# Altium project nixie display ark.PrjPCB
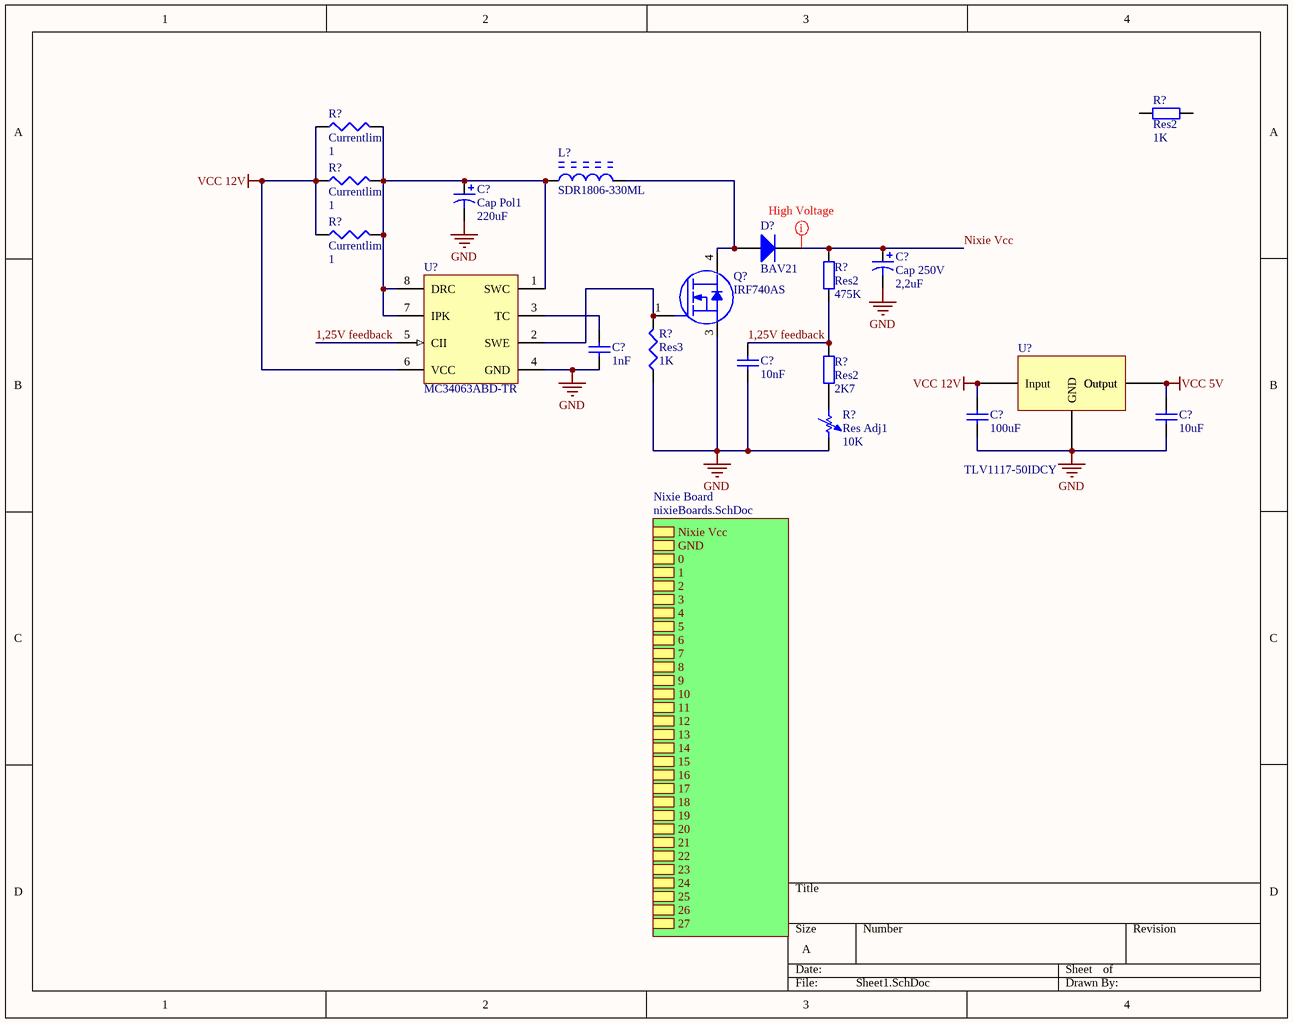
[diagram p0: Sheet1.SchDoc]
2 sheets, 31 parts. Net scope: hierarchical (ports join the sheet entries above them; power ports are global).
Sheets:
  Sheet1.SchDoc
    Nixie Board = nixieBoards.SchDoc

## Sheet Sheet1.SchDoc
size A

### Parts
(Parts that share a designator on the sheet are numbered #1, #2 ... from top to bottom, then left to right.)
C?#1  Cap Pol1  value 220uF  [RB7.6-15]
C?#2  Cap 250V  value 2,2uF  [RB7.6-15]
C?#3  1nF  [CAPC0805(2012)145_M]
C?#4  10nF  [CAPC0805(2012)145_M]
C?#5  100uF  [CAPC0805(2012)145_M]
C?#6  10uF  [CAPC0805(2012)145_M]
D?  BAV21  [DO-41]
L?  SDR1806-330ML  [BOUR-SDR1806_V]
Q?  IRF740AS  [TO-263AB]
R?#1  Res2  value 1K  [AXIAL-0.4]
R?#2  Currentlim  value 1  [J1-0603]
R?#3  Currentlim  value 1  [J1-0603]
R?#4  Currentlim  value 1  [J1-0603]
R?#5  Res2  value 475K  [AXIAL-0.4]
R?#6  Res3  value 1K  [J1-0603]
R?#7  Res2  value 2K7  [AXIAL-0.4]
R?#8  Res Adj1  value 10K  [AXIAL-0.7]
U?#1  MC34063ABD-TR  [SO8_N]
U?#2  TLV1117-50IDCY  [SOT-223-2]

### Sub-sheets
Nixie Board = nixieBoards.SchDoc: Nixie Vcc, GND, 0, 1, 2, 3, 4, 5, 6, 7, 8, 9, 10, 11, 12, 13, 14, 15, 16, 17, 18, 19, 20, 21, 22, 23, 24, 25, 26, 27

### Nets
GND: C?#1.2 C?#2.2 C?#3.1 C?#4.1 C?#5.1 C?#6.1 Q?.3(Drain) R?#6.1 R?#8.2 U?#1.4(GND) U?#2.1(GND)
VCC 5V: C?#6.2 U?#2.2(Output) U?#2.4(Output)
VCC 12V: C?#5.2 R?#2.1 R?#3.1 R?#4.1 U?#1.6(VCC) U?#2.3(Input)
1,25V feedback: C?#4.2 R?#5.1 R?#7.2 U?#1.5(CII)
Nixie Vcc: C?#2.1 D?.2(K) R?#5.2
NetC?#1_1: C?#1.1 L?.1 R?#2.2 R?#3.2 R?#4.2 U?#1.1(SWC) U?#1.7(IPK) U?#1.8(DRC)
NetC?#3_2: C?#3.2 U?#1.3(TC)
NetD?_1: D?.1(A) L?.2 Q?.4(Source)
NetQ?_1: Q?.1(Gate) R?#6.2 U?#1.2(SWE)
NetR?#7_1: R?#7.1 R?#8.1

Not connected (* = marked no-connect by the designer): R?#1 1 2

### Layout directives
mark named High Voltage: Nixie Vcc

### Library data of the parts
C?#1 C?#2 = Cap Pol1: Polarized Capacitor (Radial); Published: 8-Jun-2000; LatestRevisionDate: 17-Jul-2002; LatestRevisionNote: Re-released for DXP Platform.; PackageReference: RB7.6-15; Publisher: Altium Limited; PackageDescription: Polarized Capacitor (Radial); 2 Leads
C?#3 C?#4 = CMP-1036-03245-1: CAP 2.2nF 16V ±10% 0805 (2012 Metric) Thickness 1.45mm SMD; Case-EIA: 0805; Tolerance: Â±10%; Case-Metric: 2012; Rated Voltage: 16 V; Technology: SMT; Value: 2.2nF; Max Thickness: 1.45 mm
C?#5 C?#6 = CMP-1036-03245-1: Rated Voltage: 16 V; Case-EIA: 0805; Tolerance: Â±10%; Case-Metric: 2012; Technology: SMT; Max Thickness: 1.45 mm
  C?#5: Value: 100uF
  C?#6: Value: 10uF
D? = Diode 1N4006: Published: 8-Jun-2000; LatestRevisionDate: 17-Jul-2002; LatestRevisionNote: Re-released for DXP Platform.; DatasheetVersion: 1998; PackageVersion: Aug-1999; PackageReference: DO-41; Publisher: Altium Limited; PackageDescription: Diode, Axial; Body 5.2 x 2.7 mm (LxDia. max), Lead Dia. 0.86 mm (max); Code_JEDEC: DO-204-AL; ComponentLink1Description: Manufacturer Link; ComponentLink1URL: http://www.fairchildsemi.com/; ComponentLink2Description: Datasheet; ComponentLink2URL: http://www.fairchildsemi.com/ds/1N%2F1N4001.pdf
L? = CMP-2000-07043-1: Power Inductor, 33 uH, +/- 20%, -40 to 125 degC, 2-Pin SMD, RoHS, Tape and Reel; Manufacturer: Bourns; Minimum Quality Factor: 24@2.52MHz; Product Height: 6.9mm; Core Material: Ferrite; Maximum DC Current: 3A; Maximum DC Resistance: 68mOhm; Product Depth: 14.3mm; Inductance: 33uH; Rad Hard: No; Packaging: Tape&Reel; Mounting Technology: SurfaceMount; Manufacturer URL: http://www.bourns.com/; Package Description: 2-Pin Surface Mount Device, Body 18.3 x 14 mm; Type: Power; Package Reference: SDR1806; Datasheet URL: http://www.bourns.com/docs/Product-Datasheets/SDR1806.pdf; Tolerance: 20%; Datasheet Version: 09/2010; Package/Case: 18.6X14.3X6.9
Q? = 4548: NMos tranistor; id: 4548; pakke_opprettet_av: 2099; pris: 0; produsent: Vishay; pakketype: TO-263; pakke_opprettet: 11.10.2018 00:43:09; symbol_opprettet_av: 2099; symbol_opprettet: 11.10.2018 00:41:25; navn: IRF740AS
R?#1 R?#5 R?#7 = Res2: Resistor; Published: 8-Jun-2000; LatestRevisionDate: 17-Jul-2002; LatestRevisionNote: Re-released for DXP Platform.; PackageReference: AXIAL-0.4; Publisher: Altium Limited; PackageDescription: Axial Device, Thru-Hole; 2 Leads; 0.4 in Pin Spacing
R?#2-R?#4 R?#6 = Res3: Resistor; Published: 8-Jun-2000; LatestRevisionDate: 29-May-2009; LatestRevisionNote: IPC-7351 Footprint Added.; PackageReference: J1-0603; Publisher: Altium Limited; PackageDescription: Chip Resistor
R?#8 = Res Adj1: Variable Resistor; Set Position: 0.5; Published: 8-Jun-2000; LatestRevisionDate: 17-Jul-2002; LatestRevisionNote: Re-released for DXP Platform.; PackageReference: AXIAL-0.7; Publisher: Altium Limited; PackageDescription: Axial Device, Thru-Hole; 2 Leads; 0.7 in Pin Spacing
U?#1 = CMP-0241-00017-1: DC/DC converter control circuit, 8-Pin SO, Tape and Reel; PackageReference: SO8; DatasheetVersion: Nov-2007; PackageDescription: 8-Pin Small Outline Integrated Circuit 1.27 mm Pitch; ComponentLink3URL: http://www.st.com/internet/com/TECHNICAL_RESOURCES/TECHNICAL_LITERATURE/PACKAGE_INFORMATION/CD00004680.pdf; ComponentLink2Description: Datasheet; PackageVersion: Dec-2002; ComponentLink1URL: http://www.st.com; ComponentLink2URL: http://www.st.com/internet/com/TECHNICAL_RESOURCES/TECHNICAL_LITERATURE/DATASHEET/CD00001232.pdf; ComponentLink1Description: Manufacturer URL; ComponentLink3Description: Package Specification; Code_IPC: SOIC127P600-8; Code_JEDEC: MS-012-AA
U?#2 = TLV1117: ComponentLink1Description: TLV1117-50IDCY - Farnell; ComponentLink1URL: https://no.farnell.com/texas-instruments/tlv1117-50idcy/ic-ldo-reg-800ma-5v-sot223-4/dp/1755289?st=TLV1117

## Sheet nixieBoards.SchDoc
size A
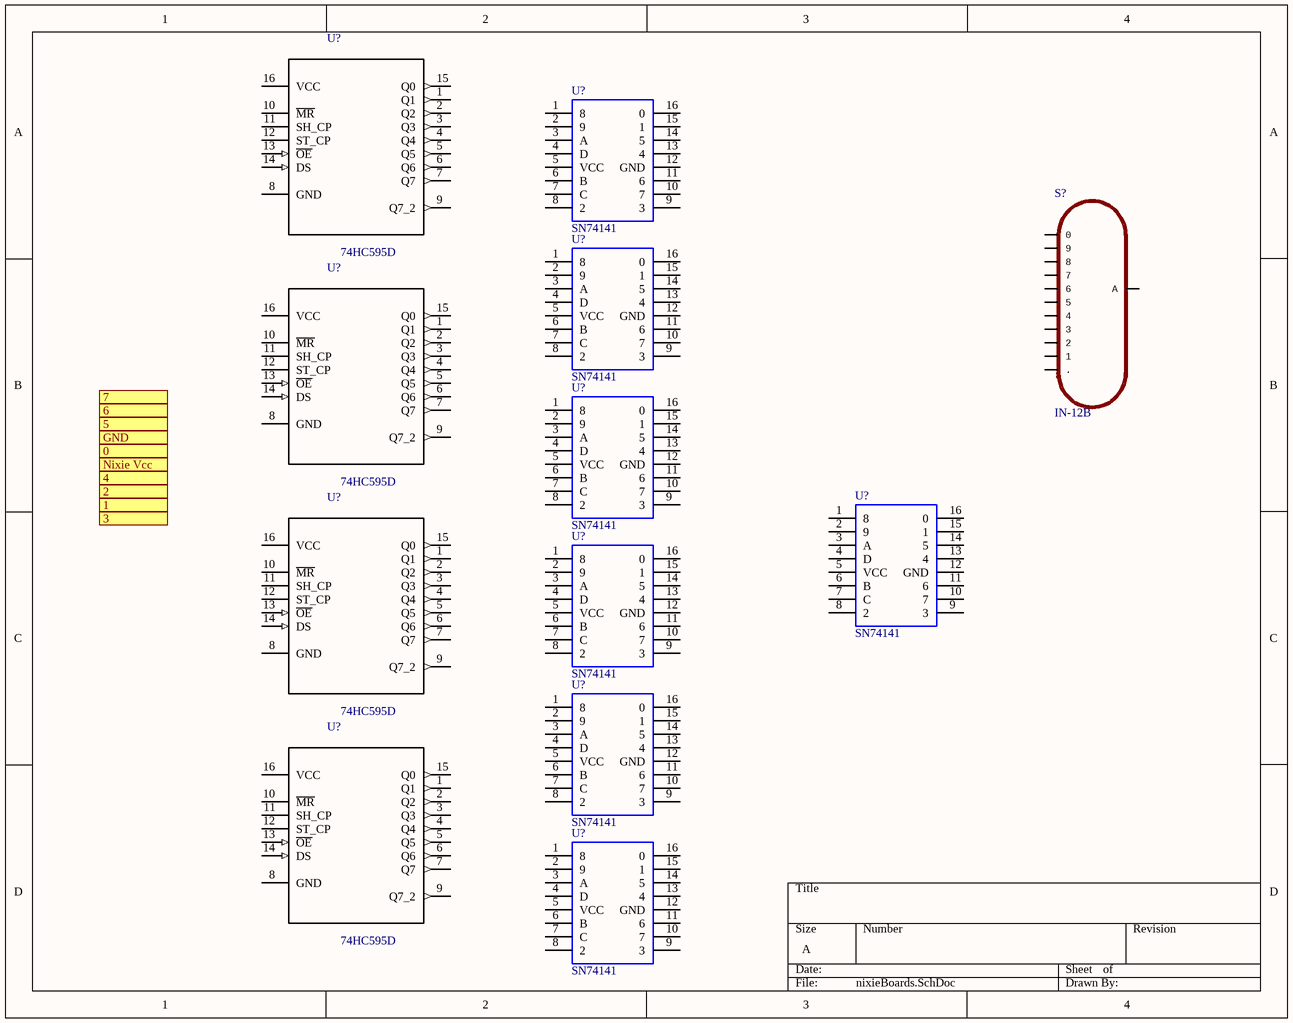
[diagram p1: nixieBoards.SchDoc]

### Parts
(Parts that share a designator on the sheet are numbered #1, #2 ... from top to bottom, then left to right.)
S?  IN-12B  [IN-12]
U?#3  SN74141  [CircuitWorks-DIP16]
U?#4  74HC595D  [SOIC127P600X175-16N]
U?#5  SN74141  [CircuitWorks-DIP16]
U?#6  74HC595D  [SOIC127P600X175-16N]
U?#7  SN74141  [CircuitWorks-DIP16]
U?#8  SN74141  [CircuitWorks-DIP16]
U?#9  SN74141  [CircuitWorks-DIP16]
U?#10  74HC595D  [SOIC127P600X175-16N]
U?#11  SN74141  [CircuitWorks-DIP16]
U?#12  74HC595D  [SOIC127P600X175-16N]
U?#13  SN74141  [CircuitWorks-DIP16]

### Ports
0, 1, 2, 3, 4, 5, 6, 7, GND, Nixie Vcc

### Nets

Not connected (* = marked no-connect by the designer): S? 0(2) 1(A) 2(0) 3(9) 4(8) 5(7) 6 7(5) 8(4) 9(3) A(1) LHDP(.); U?#3 1(8) 2(9) 3(A) 4(D) 5(VCC) 6(B) 7(C) 8(2) 9(3) 10(7) 11(6) 12(GND) 13(4) 14(5) 15(1) 16(0); U?#4 1(Q1) 2(Q2) 3(Q3) 4(Q4) 5(Q5) 6(Q6) 7(Q7) 8(GND) 9(Q7_2) 10(~{MR}) 11(SH_CP) 12(ST_CP) 13(~{OE}) 14(DS) 15(Q0) 16(VCC); U?#5 1(8) 2(9) 3(A) 4(D) 5(VCC) 6(B) 7(C) 8(2) 9(3) 10(7) 11(6) 12(GND) 13(4) 14(5) 15(1) 16(0); U?#6 1(Q1) 2(Q2) 3(Q3) 4(Q4) 5(Q5) 6(Q6) 7(Q7) 8(GND) 9(Q7_2) 10(~{MR}) 11(SH_CP) 12(ST_CP) 13(~{OE}) 14(DS) 15(Q0) 16(VCC); U?#7 1(8) 2(9) 3(A) 4(D) 5(VCC) 6(B) 7(C) 8(2) 9(3) 10(7) 11(6) 12(GND) 13(4) 14(5) 15(1) 16(0); U?#8 1(8) 2(9) 3(A) 4(D) 5(VCC) 6(B) 7(C) 8(2) 9(3) 10(7) 11(6) 12(GND) 13(4) 14(5) 15(1) 16(0); U?#9 1(8) 2(9) 3(A) 4(D) 5(VCC) 6(B) 7(C) 8(2) 9(3) 10(7) 11(6) 12(GND) 13(4) 14(5) 15(1) 16(0); U?#10 1(Q1) 2(Q2) 3(Q3) 4(Q4) 5(Q5) 6(Q6) 7(Q7) 8(GND) 9(Q7_2) 10(~{MR}) 11(SH_CP) 12(ST_CP) 13(~{OE}) 14(DS) 15(Q0) 16(VCC); U?#11 1(8) 2(9) 3(A) 4(D) 5(VCC) 6(B) 7(C) 8(2) 9(3) 10(7) 11(6) 12(GND) 13(4) 14(5) 15(1) 16(0); U?#12 1(Q1) 2(Q2) 3(Q3) 4(Q4) 5(Q5) 6(Q6) 7(Q7) 8(GND) 9(Q7_2) 10(~{MR}) 11(SH_CP) 12(ST_CP) 13(~{OE}) 14(DS) 15(Q0) 16(VCC); U?#13 1(8) 2(9) 3(A) 4(D) 5(VCC) 6(B) 7(C) 8(2) 9(3) 10(7) 11(6) 12(GND) 13(4) 14(5) 15(1) 16(0)

### Library data of the parts
U?#4 U?#6 U?#10 U?#12 = 74HC595D: Shift Register Single 8-Bit Serial to Serial/Parallel 16-Pin SO; MF: Toshiba; Price: None; MP: 74HC595D; SnapEDA_Link: https://www.snapeda.com/parts/74HC595D/Toshiba%20Semiconductor%20and%20Storage/view-part/?ref=snap; Package: SOIC-16 NXP Semiconductors; Availability: Unavailable; Value: *